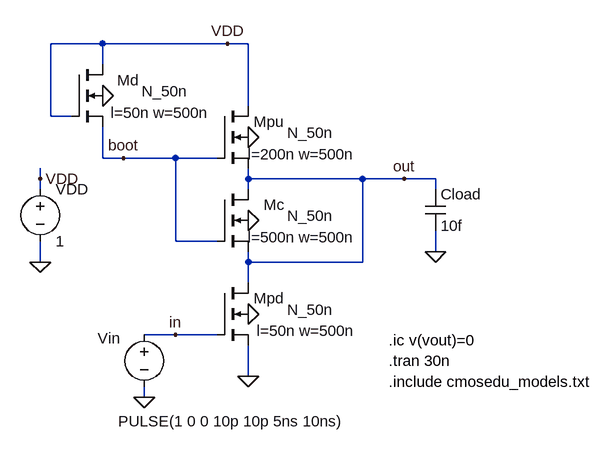
[diagram p0: schematic Fig18_40a.asc]
Fig18_40a.asc, the LTspice schematic file:
Version 4
SHEET 1 1616 680
WIRE 224 -544 144 -544
WIRE 416 -544 224 -544
WIRE 448 -544 416 -544
WIRE 224 -512 224 -544
WIRE 448 -448 448 -544
WIRE 144 -432 144 -544
WIRE 176 -432 144 -432
WIRE 224 -368 224 -416
WIRE 256 -368 224 -368
WIRE 336 -368 256 -368
WIRE 400 -368 336 -368
WIRE 128 -336 128 -352
WIRE 448 -336 448 -352
WIRE 624 -336 448 -336
WIRE 688 -336 624 -336
WIRE 736 -336 688 -336
WIRE 128 -320 128 -336
WIRE 448 -320 448 -336
WIRE 736 -320 736 -336
WIRE 336 -240 336 -368
WIRE 400 -240 336 -240
WIRE 736 -224 736 -256
WIRE 128 -208 128 -240
WIRE 448 -208 448 -224
WIRE 624 -208 624 -336
WIRE 624 -208 448 -208
WIRE 448 -176 448 -208
WIRE 336 -96 288 -96
WIRE 400 -96 336 -96
WIRE 448 -32 448 -80
WIRE 288 0 288 -16
FLAG 288 0 0
FLAG 448 -128 0
FLAG 128 -208 0
FLAG 128 -336 VDD
FLAG 448 -32 0
FLAG 448 -272 0
FLAG 448 -400 0
FLAG 224 -464 0
FLAG 416 -544 VDD
FLAG 256 -368 boot
FLAG 336 -96 in
FLAG 688 -336 out
FLAG 736 -224 0
SYMBOL nmos4 400 -176 R0
WINDOW 0 104 24 Right 0
WINDOW 3 179 41 Right 0
WINDOW 123 213 74 Right 0
SYMATTR InstName Mpd
SYMATTR Value N_50n
SYMATTR Value2 l=50n w=500n
SYMBOL voltage 288 -112 R0
WINDOW 0 -72 21 Left 0
WINDOW 3 -40 149 Left 0
WINDOW 123 0 0 Left 0
WINDOW 39 0 0 Left 0
SYMATTR InstName Vin
SYMATTR Value PULSE(1 0 0 10p 10p 5ns 10ns)
SYMBOL voltage 128 -336 R0
WINDOW 123 0 0 Left 0
WINDOW 39 0 0 Left 0
SYMATTR InstName VDD
SYMATTR Value 1
SYMBOL nmos4 400 -320 R0
WINDOW 0 104 24 Right 0
WINDOW 3 179 41 Right 0
WINDOW 123 213 74 Right 0
SYMATTR InstName Mc
SYMATTR Value N_50n
SYMATTR Value2 l=500n w=500n
SYMBOL nmos4 400 -448 R0
WINDOW 0 104 24 Right 0
WINDOW 3 179 41 Right 0
WINDOW 123 213 74 Right 0
SYMATTR InstName Mpu
SYMATTR Value N_50n
SYMATTR Value2 l=200n w=500n
SYMBOL nmos4 176 -512 R0
WINDOW 0 104 24 Right 0
WINDOW 3 179 41 Right 0
WINDOW 123 213 74 Right 0
SYMATTR InstName Md
SYMATTR Value N_50n
SYMATTR Value2 l=50n w=500n
SYMBOL cap 720 -320 R0
SYMATTR InstName Cload
SYMATTR Value 10f
TEXT 664 -56 Left 0 !.tran 30n
TEXT 664 -24 Left 0 !.include cmosedu_models.txt
TEXT 664 -88 Left 0 !.ic v(vout)=0

The netlist it stands for:
* Fig18_40a.asc
Mpd out in 0 0 N_50n l=50n w=500n
Vin in 0 PULSE(1 0 0 10p 10p 5ns 10ns)
VDD VDD 0 1
Mc out boot out 0 N_50n l=500n w=500n
Mpu VDD boot out 0 N_50n l=200n w=500n
Md VDD VDD boot 0 N_50n l=50n w=500n
Cload out 0 10f
.model NMOS NMOS
.model PMOS PMOS
.lib standard.mos
.tran 30n
.include cmosedu_models.txt
.ic v(vout)=0
.backanno
.end